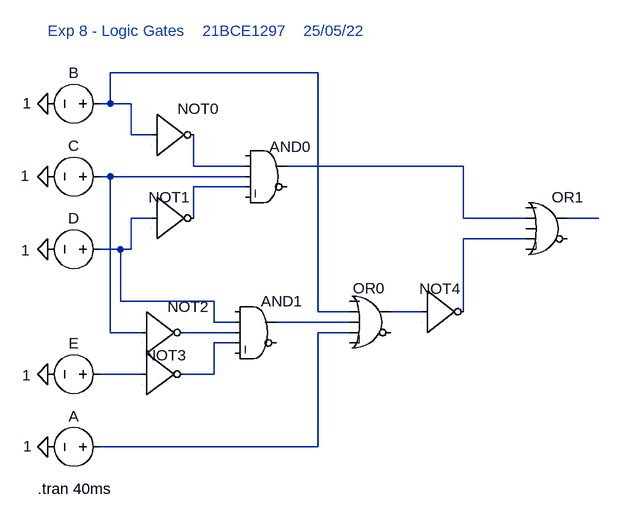
[diagram p0: schematic Expression3.asc]
Expression3.asc, the LTspice schematic file:
Version 4
SHEET 1 880 680
WIRE 320 -16 0 -16
WIRE 0 32 0 -16
WIRE 0 32 -16 32
WIRE 32 32 0 32
WIRE 32 80 32 32
WIRE 64 80 32 80
WIRE 128 128 128 80
WIRE 208 128 128 128
WIRE 544 128 272 128
WIRE 0 144 -16 144
WIRE 208 144 0 144
WIRE 208 160 128 160
WIRE 64 208 32 208
WIRE 128 208 128 160
WIRE 544 208 544 128
WIRE 640 208 544 208
WIRE 752 208 704 208
WIRE 640 240 544 240
WIRE 16 256 -16 256
WIRE 32 256 32 208
WIRE 32 256 16 256
WIRE 16 336 16 256
WIRE 160 336 16 336
WIRE 320 352 320 -16
WIRE 368 352 320 352
WIRE 480 352 432 352
WIRE 544 352 544 240
WIRE 160 368 160 336
WIRE 192 368 160 368
WIRE 368 368 256 368
WIRE 0 384 0 144
WIRE 48 384 0 384
WIRE 192 384 112 384
WIRE 368 384 320 384
WIRE 192 400 160 400
WIRE 48 448 -16 448
WIRE 160 448 160 400
WIRE 160 448 112 448
WIRE 320 560 320 384
WIRE 320 560 -16 560
FLAG -96 560 0
FLAG -96 32 0
FLAG -96 144 0
FLAG -96 256 0
FLAG -96 448 0
SYMBOL voltage 0 560 R90
WINDOW 0 -32 56 VBottom 2
WINDOW 3 -17 127 VTop 2
SYMATTR InstName A
SYMATTR Value 1
SYMBOL voltage 0 32 R90
WINDOW 0 -32 56 VBottom 2
WINDOW 3 -16 128 VTop 2
SYMATTR InstName B
SYMATTR Value 1
SYMBOL voltage 0 144 R90
WINDOW 0 -32 56 VBottom 2
WINDOW 3 -17 131 VTop 2
SYMATTR InstName C
SYMATTR Value 1
SYMBOL voltage 0 256 R90
WINDOW 0 -32 56 VBottom 2
WINDOW 3 -14 130 VTop 2
SYMATTR InstName D
SYMATTR Value 1
SYMBOL voltage 0 448 R90
WINDOW 0 -32 56 VBottom 2
WINDOW 3 -14 129 VTop 2
SYMATTR InstName E
SYMATTR Value 1
SYMBOL Digital\\and 240 80 R0
WINDOW 0 5 18 Left 2
SYMATTR InstName AND0
SYMBOL Digital\\inv 64 16 R0
SYMATTR InstName NOT0
SYMBOL Digital\\inv 64 144 R0
WINDOW 0 -5 32 Left 2
SYMATTR InstName NOT1
SYMBOL Digital\\and 224 320 R0
SYMATTR InstName AND1
SYMBOL Digital\\inv 48 320 R0
SYMATTR InstName NOT2
SYMBOL Digital\\inv 48 384 R0
WINDOW 0 6 35 Left 2
SYMATTR InstName NOT3
SYMBOL Digital\\or 400 304 R0
WINDOW 0 -26 12 Left 2
SYMATTR InstName OR0
SYMBOL Digital\\inv 480 288 R0
WINDOW 0 -4 29 Left 2
SYMATTR InstName NOT4
SYMBOL Digital\\or 672 160 R0
SYMATTR InstName OR1
TEXT -96 -80 Left 2 ;Exp 8 - Logic Gates    21BCE1297    25/05/22
TEXT -112 624 Left 2 !.tran 40ms

The netlist it stands for:
* Expression3.asc
V§A N012 0 1
V§B N001 0 1
V§C N004 0 1
V§D N006 0 1
V§E N014 0 1
AND0 0 N002 N004 N005 0 0 N003 0 AND
A§NOT0 N001 0 0 0 0 N002 0 0 BUF
A§NOT1 N006 0 0 0 0 N005 0 0 BUF
AND1 0 N006 N011 N013 0 0 N010 0 AND
A§NOT2 N004 0 0 0 0 N011 0 0 BUF
A§NOT3 N014 0 0 0 0 N013 0 0 BUF
A§OR0 0 N001 N010 N012 0 0 N009 0 OR
A§NOT4 N009 0 0 0 0 N008 0 0 BUF
A§OR1 0 N003 0 N008 0 0 N007 0 OR
* Exp 8 - Logic Gates    21BCE1297    25/05/22
.tran 40ms
.backanno
.end